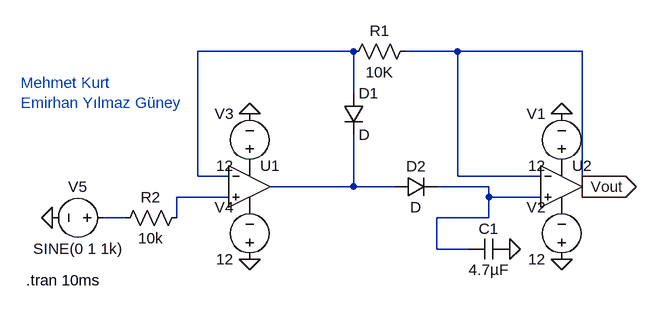
[diagram p0: schematic Peak Detector Circuitry.asc]
Peak Detector Circuitry.asc, the LTspice schematic file:
Version 4
SHEET 1 880 680
WIRE 176 -32 -64 -32
WIRE 336 -32 256 -32
WIRE 528 -32 336 -32
WIRE 176 32 176 -32
WIRE -64 160 -64 -32
WIRE -16 160 -64 160
WIRE 336 160 336 -32
WIRE 464 160 336 160
WIRE 176 176 176 96
WIRE 176 176 48 176
WIRE 240 176 176 176
WIRE 384 176 304 176
WIRE 528 176 528 -32
WIRE -16 192 -96 192
WIRE 384 192 384 176
WIRE 464 192 384 192
WIRE -176 224 -208 224
WIRE -96 224 -96 192
WIRE 384 224 384 192
WIRE 384 224 304 224
WIRE 304 272 304 224
WIRE 352 272 304 272
FLAG 416 272 0
FLAG 496 288 0
FLAG 496 64 0
FLAG 16 288 0
FLAG 16 64 0
FLAG 528 176 Vout
IOPIN 528 176 Out
FLAG -288 224 0
SYMBOL OpAmps\\UniversalOpAmp2 16 176 R0
SYMATTR InstName U1
SYMBOL diode 160 32 R0
SYMATTR InstName D1
SYMBOL diode 240 192 R270
WINDOW 0 32 32 VTop 2
WINDOW 3 0 32 VBottom 2
SYMATTR InstName D2
SYMBOL cap 416 256 R90
WINDOW 0 0 32 VBottom 2
WINDOW 3 32 32 VTop 2
SYMATTR InstName C1
SYMATTR Value 4.7µF
SYMBOL OpAmps\\UniversalOpAmp2 496 176 R0
SYMATTR InstName U2
SYMBOL res 272 -48 R90
WINDOW 0 0 56 VBottom 2
WINDOW 3 32 56 VTop 2
SYMATTR InstName R1
SYMATTR Value 10K
SYMBOL res -80 208 R90
WINDOW 0 0 56 VBottom 2
WINDOW 3 32 56 VTop 2
SYMATTR InstName R2
SYMATTR Value 10k
SYMBOL voltage 496 160 R180
WINDOW 0 24 96 Left 2
WINDOW 3 24 16 Left 2
WINDOW 123 0 0 Left 0
WINDOW 39 0 0 Left 0
SYMATTR InstName V1
SYMATTR Value 12
SYMBOL voltage 496 304 R180
WINDOW 0 24 96 Left 2
WINDOW 3 24 16 Left 2
WINDOW 123 0 0 Left 0
WINDOW 39 0 0 Left 0
SYMATTR InstName V2
SYMATTR Value 12
SYMBOL voltage 16 160 R180
WINDOW 0 24 96 Left 2
WINDOW 3 24 16 Left 2
WINDOW 123 0 0 Left 0
WINDOW 39 0 0 Left 0
SYMATTR InstName V3
SYMATTR Value 12
SYMBOL voltage 16 304 R180
WINDOW 0 24 96 Left 2
WINDOW 3 24 16 Left 2
WINDOW 123 0 0 Left 0
WINDOW 39 0 0 Left 0
SYMATTR InstName V4
SYMATTR Value 12
SYMBOL voltage -192 224 R90
WINDOW 0 -32 56 VBottom 2
WINDOW 3 32 56 VTop 2
WINDOW 123 0 0 Left 0
WINDOW 39 0 0 Left 0
SYMATTR InstName V5
SYMATTR Value SINE(0 1 1k)
TEXT -328 320 Left 2 !.tran 10ms
TEXT -336 16 Left 2 ;Mehmet Kurt\nEmirhan Yılmaz Güney

The netlist it stands for:
* Peak Detector Circuitry.asc
XU1 N004 N001 P001 P002 N002 level2 Avol=1Meg GBW=10Meg Slew=10Meg Ilimit=25m Rail=0 Vos=0 En=0 Enk=0 In=0 Ink=0 Rin=500Meg  ; pins In+ In- V+ V- OUT
D1 N001 N002 D
D2 N002 N003 D
C1 0 N003 4.7µF
XU2 N003 Vout P003 P004 Vout level2 Avol=1Meg GBW=10Meg Slew=10Meg Ilimit=25m Rail=0 Vos=0 En=0 Enk=0 In=0 Ink=0 Rin=500Meg  ; pins In+ In- V+ V- OUT
R1 Vout N001 10K
R2 N004 N005 10k
V1 P003 0 12
V2 0 P004 12
V3 P001 0 12
V4 0 P002 12
V5 N005 0 SINE(0 1 1k)
.model D D
.lib standard.dio
.tran 10ms
* Mehmet Kurt
* Emirhan Yılmaz Güney
.lib UniversalOpAmp2.lib
.backanno
.end